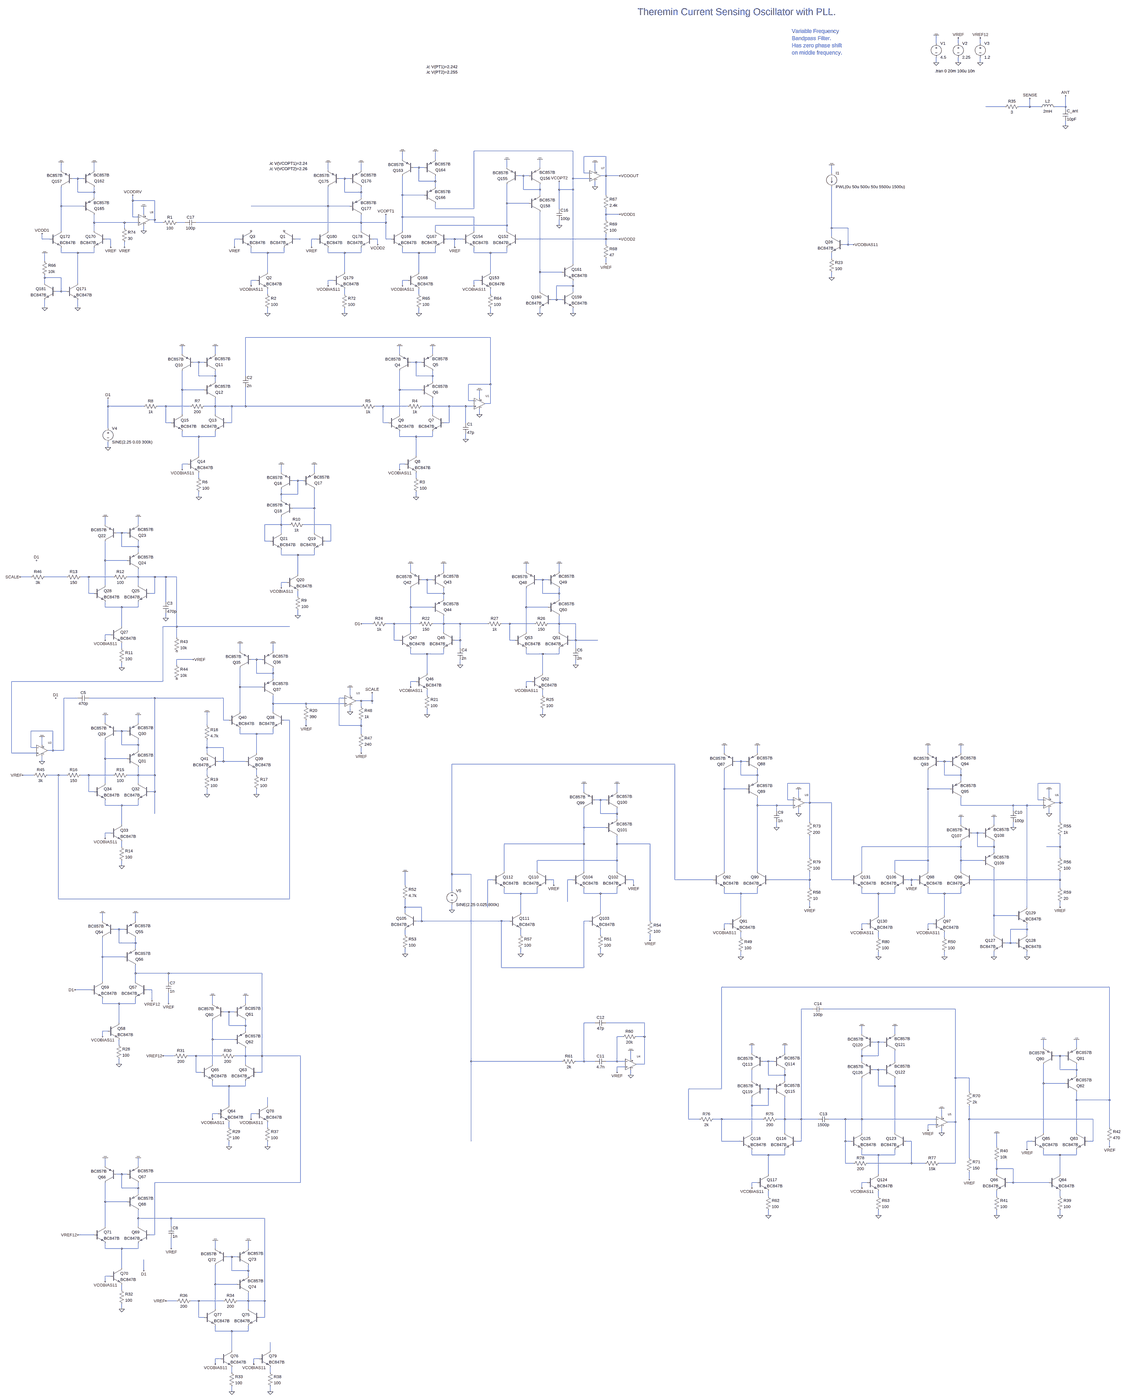
[diagram p0: schematic vco_and_lc_drive_v08.asc, whole sheet]
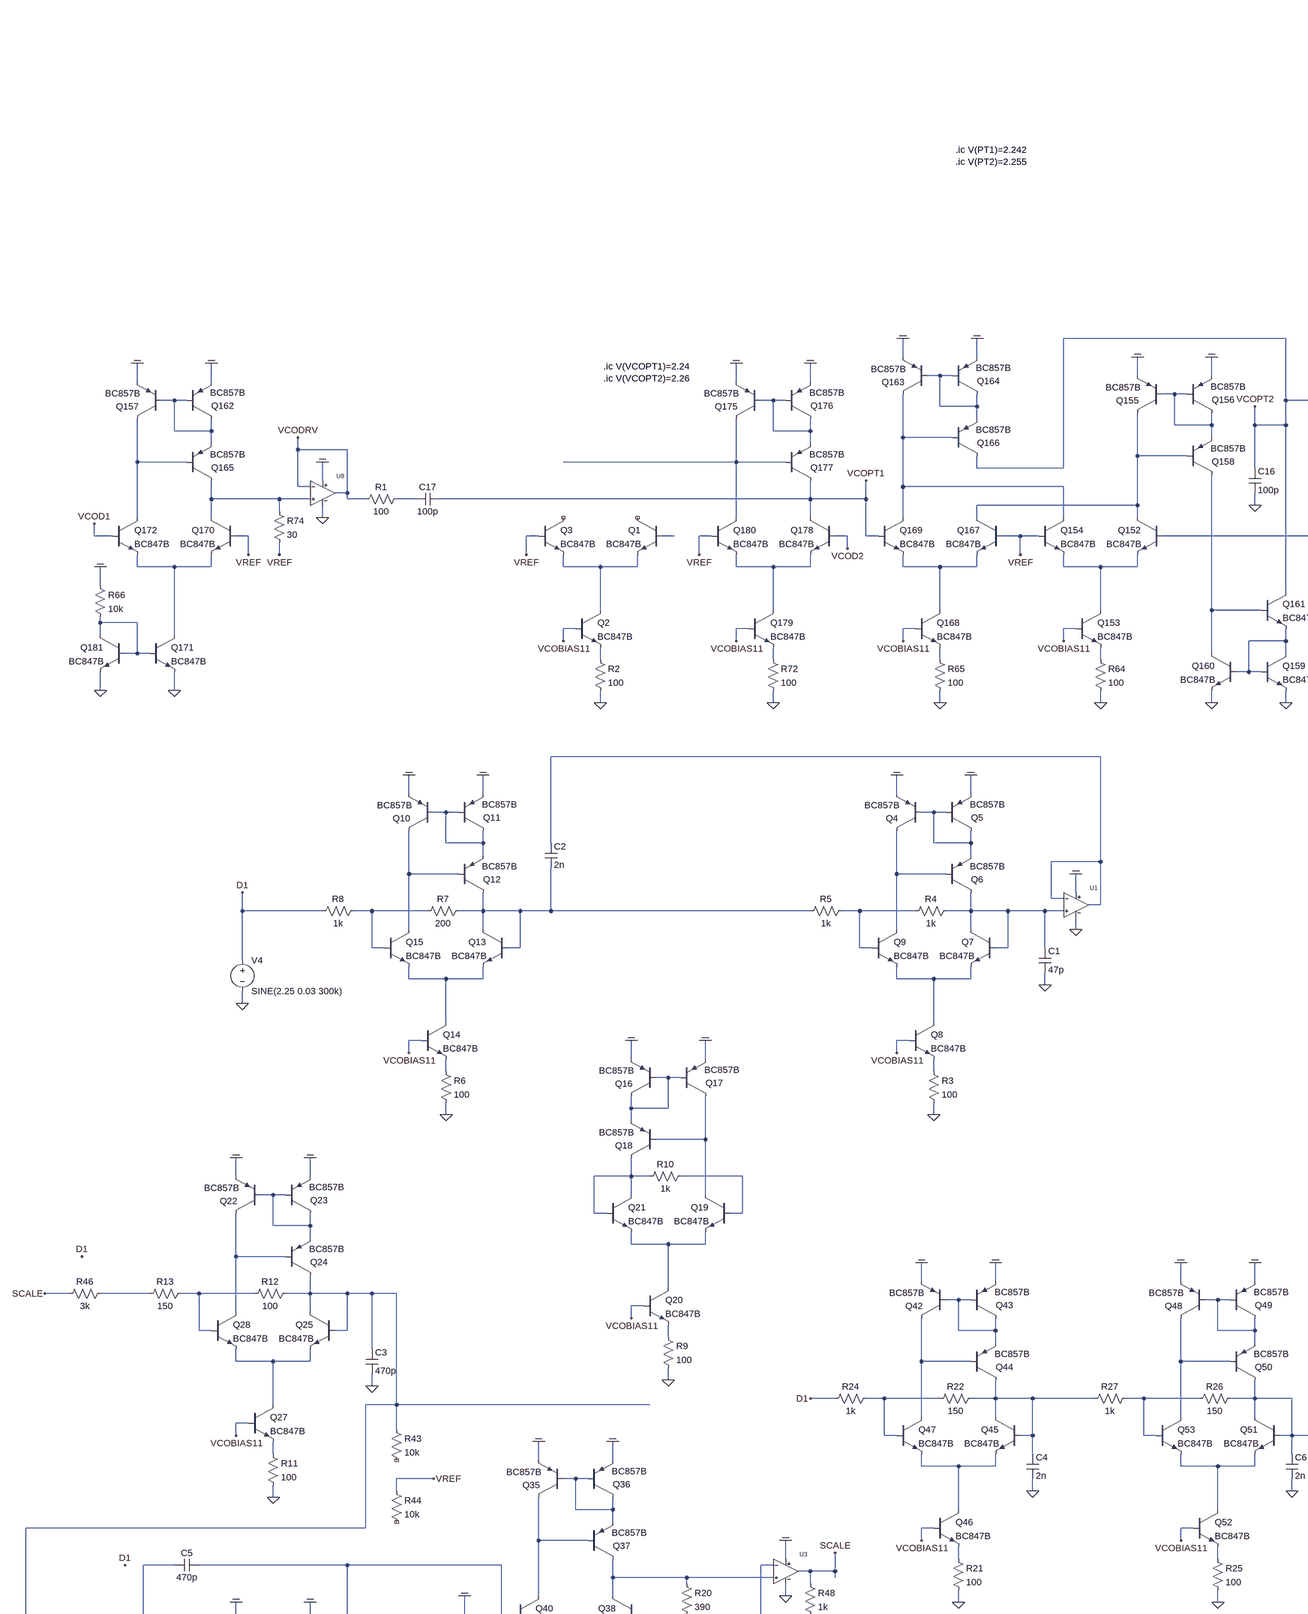
[diagram p1: schematic vco_and_lc_drive_v08.asc, part, row 1 of 2, column 1 of 2]
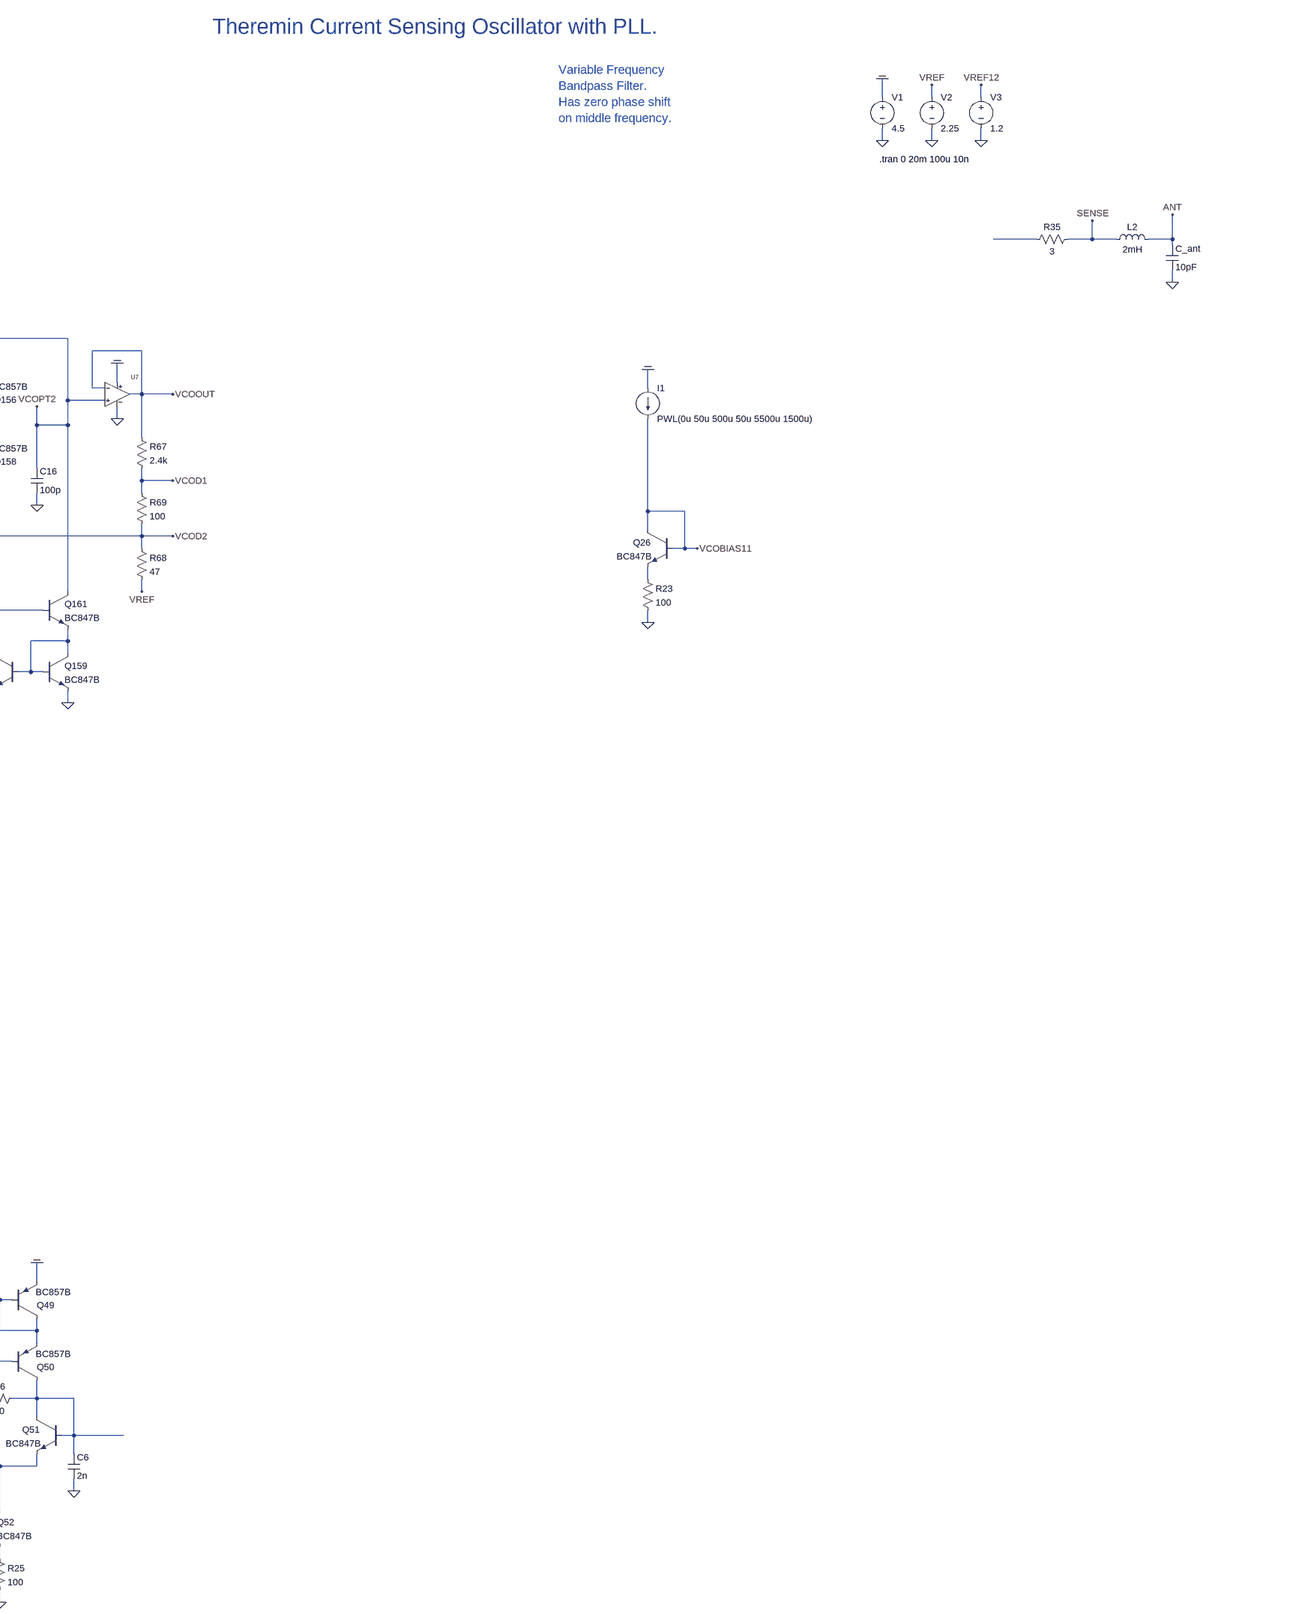
[diagram p2: schematic vco_and_lc_drive_v08.asc, part, row 1 of 2, column 2 of 2]
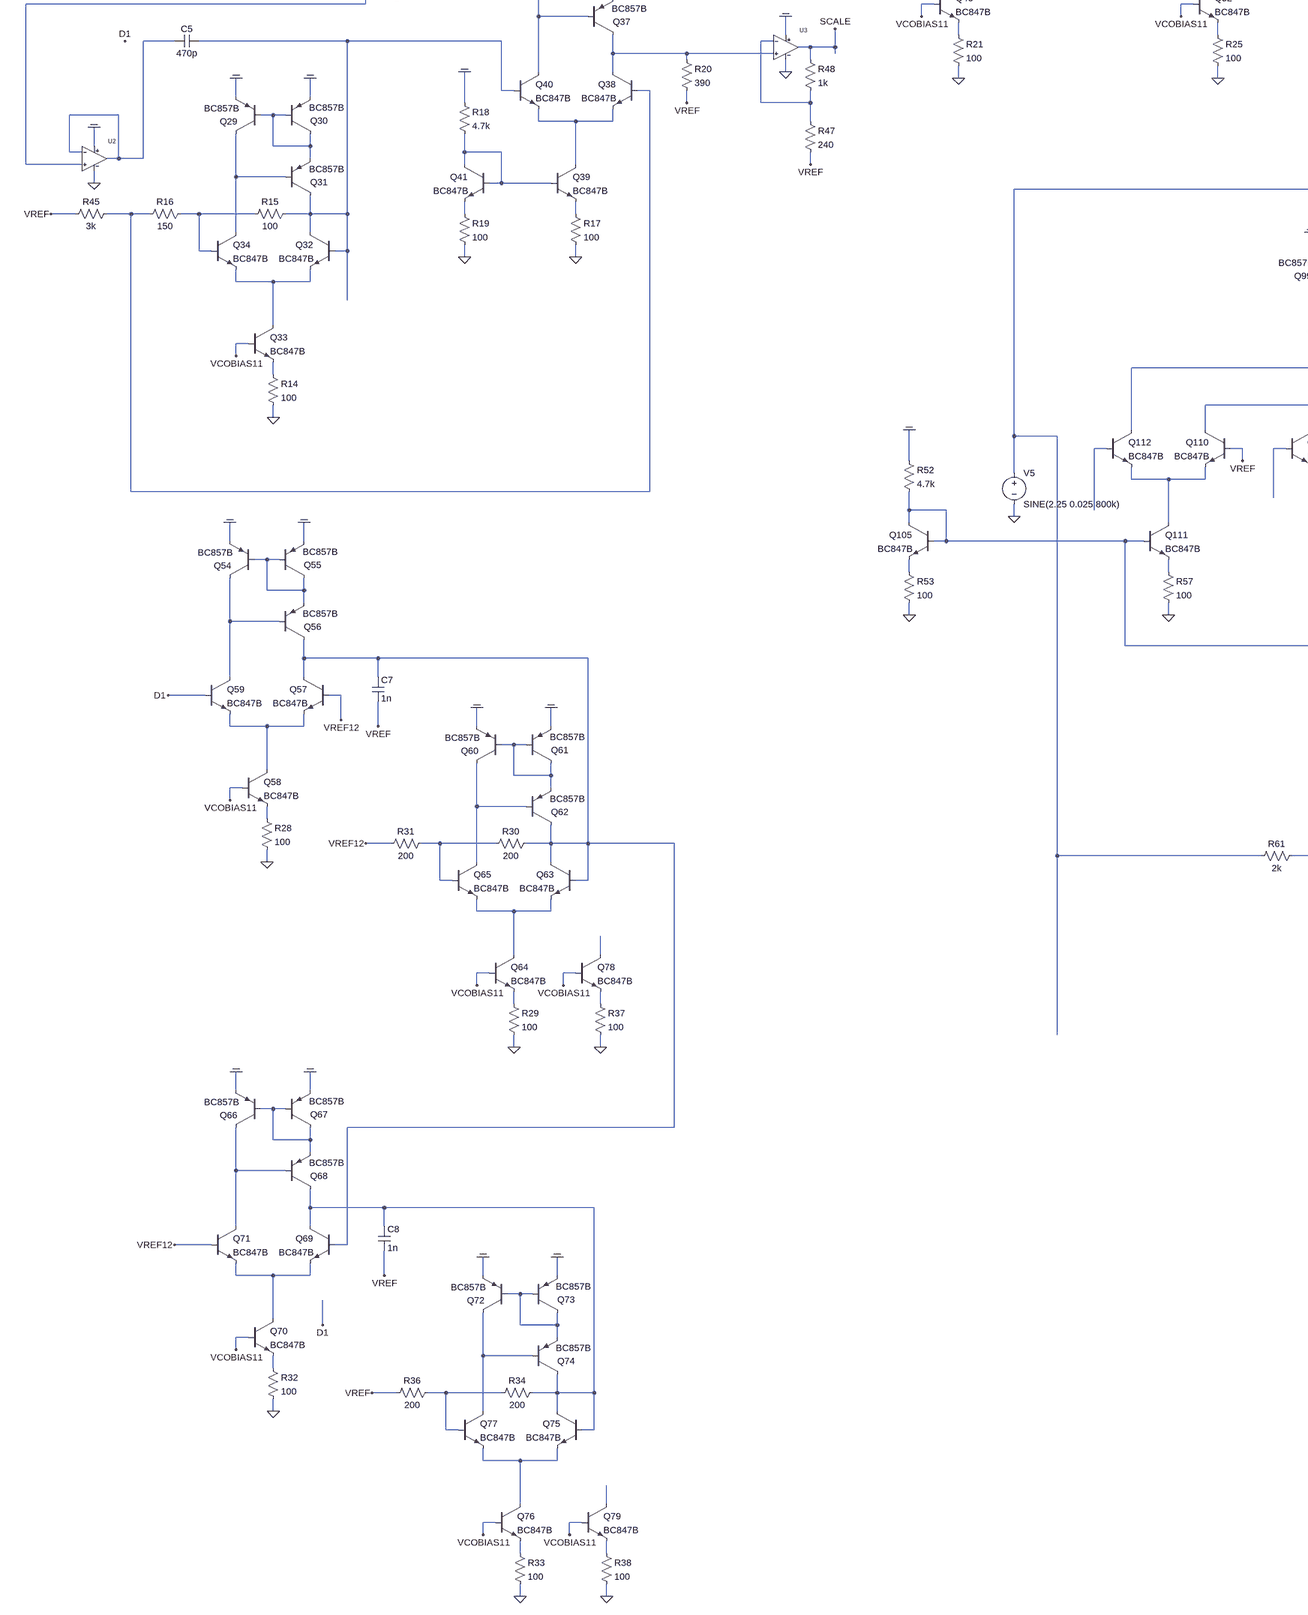
[diagram p3: schematic vco_and_lc_drive_v08.asc, part, row 2 of 2, column 1 of 2]
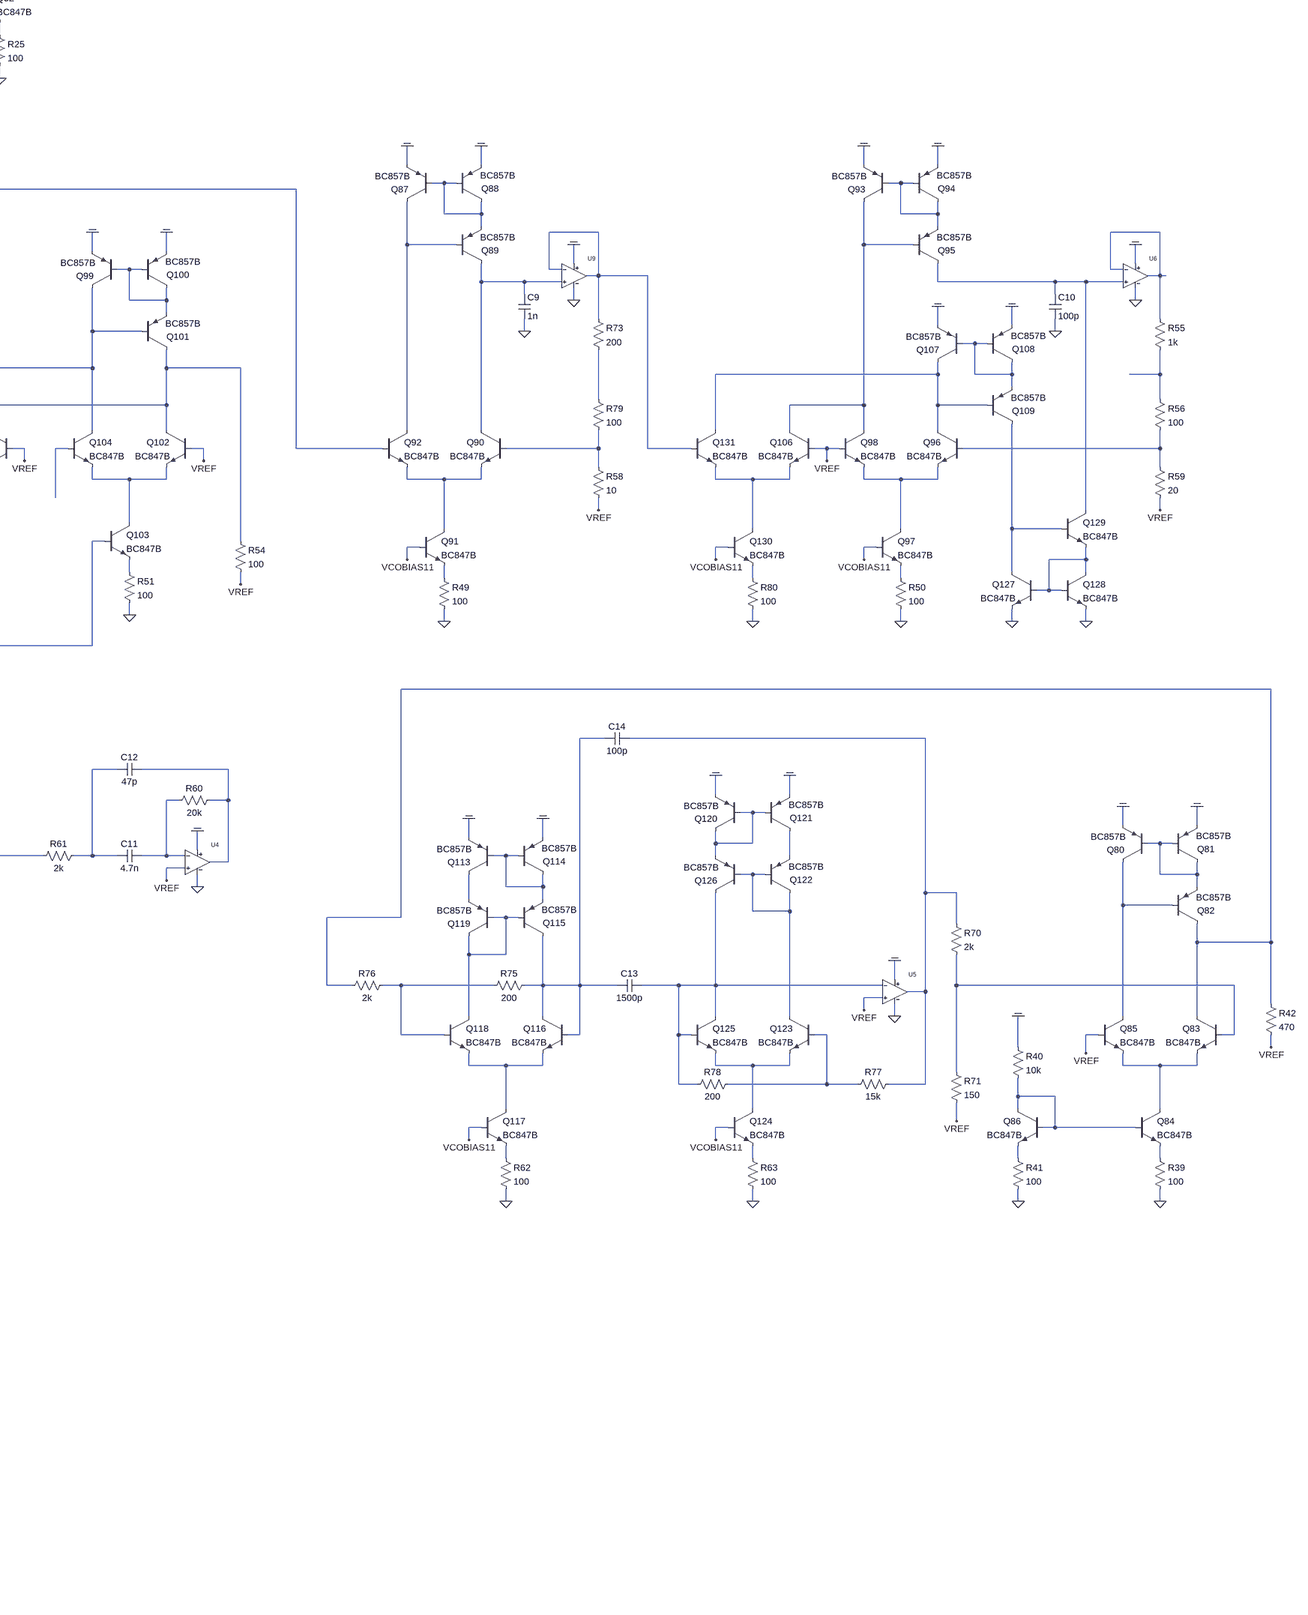
[diagram p4: schematic vco_and_lc_drive_v08.asc, part, row 2 of 2, column 2 of 2]
* vco_and_lc_drive_v08.asc
V1 COM 0 4.5
V2 VREF 0 2.25
L2 SENSE ANT 2mH Rser=120 Cpar=1pF
C_ant ANT 0 10pF
R35 N001 SENSE 3
V3 VREF12 0 1.2
Q26 VCOBIAS11 VCOBIAS11 N018 0 BC847B
R23 N018 0 100
I1 COM VCOBIAS11 PWL(0u 50u 500u 50u 5500u 1500u)
Q152 N007 VCOD2 N017 0 BC847B
Q153 N017 VCOBIAS11 N025 0 BC847B
Q154 N006 VREF N017 0 BC847B
R64 N025 0 100
Q155 N007 N003 COM 0 BC857B
Q156 N003 N003 COM 0 BC857B
Q158 N019 N007 N003 0 BC857B
Q159 N021 N021 0 0 BC847B
Q160 N019 N021 0 0 BC847B
Q161 VCOPT2 N019 N021 0 BC847B
Q163 N006 N002 COM 0 BC857B
Q164 N002 N002 COM 0 BC857B
Q166 VCOPT2 N006 N002 0 BC857B
Q167 N007 VREF N016 0 BC847B
Q168 N016 VCOBIAS11 N024 0 BC847B
Q169 N006 VCOPT1 N016 0 BC847B
R65 N024 0 100
C16 VCOPT2 0 100p
R67 VCOOUT VCOD1 2.4k
R68 VCOD2 VREF 47
R69 VCOD1 VCOD2 100
XU7 VCOPT2 VCOOUT COM 0 VCOOUT MCP6021  ; pins In+ In- V+ V- OUT
Q157 N008 N004 COM 0 BC857B
Q162 N004 N004 COM 0 BC857B
Q165 N010 N008 N004 0 BC857B
Q170 N010 VREF N013 0 BC847B
Q171 N013 N020 0 0 BC847B
Q172 N008 VCOD1 N013 0 BC847B
Q175 N009 N005 COM 0 BC857B
Q176 N005 N005 COM 0 BC857B
Q177 VCOPT1 N009 N005 0 BC857B
Q178 VCOPT1 VCOD2 N015 0 BC847B
Q179 N015 VCOBIAS11 N023 0 BC847B
Q180 N009 VREF N015 0 BC847B
R72 N023 0 100
R74 N010 VREF 30
Q181 N020 N020 0 0 BC847B
R66 COM N020 10k
XU8 N010 VCODRV COM 0 VCODRV MCP6021  ; pins In+ In- V+ V- OUT
C17 VCOPT1 N011 100p
R1 N011 VCODRV 100
Q1 NC_01 N012 N014 0 BC847B
Q2 N014 VCOBIAS11 N022 0 BC847B
Q3 NC_02 VREF N014 0 BC847B
R2 N022 0 100
Q4 N030 N028 COM 0 BC857B
Q5 N028 N028 COM 0 BC857B
Q6 N034 N030 N028 0 BC857B
Q7 N034 N034 N036 0 BC847B
Q8 N036 VCOBIAS11 N038 0 BC847B
Q9 N030 N033 N036 0 BC847B
R3 N038 0 100
R4 N034 N033 1k
R5 N033 N032 1k
Q10 N029 N027 COM 0 BC857B
Q11 N027 N027 COM 0 BC857B
Q12 N032 N029 N027 0 BC857B
Q13 N032 N032 N035 0 BC847B
Q14 N035 VCOBIAS11 N037 0 BC847B
Q15 N029 N031 N035 0 BC847B
R6 N037 0 100
R7 N032 N031 200
R8 N031 D1 1k
C1 N034 0 47p
C2 N026 N032 2n
XU1 N034 N026 COM 0 N026 MCP6021  ; pins In+ In- V+ V- OUT
V4 D1 0 SINE(2.25 0.03 300k)
Q16 N039 N039 COM 0 BC857B
Q17 N040 N039 COM 0 BC857B
Q19 N040 N042 N044 0 BC847B
Q20 N044 VCOBIAS11 N051 0 BC847B
Q21 N041 N041 N044 0 BC847B
R9 N051 0 100
R10 N042 N041 1k
Q18 N041 N040 N039 0 BC857B
Q22 N045 N043 COM 0 BC857B
Q23 N043 N043 COM 0 BC857B
Q24 N048 N045 N043 0 BC857B
Q25 N048 N048 N052 0 BC847B
Q27 N052 VCOBIAS11 N059 0 BC847B
Q28 N045 N047 N052 0 BC847B
R11 N059 0 100
R12 N048 N047 100
R13 N047 N046 150
C3 N048 0 470p
Q29 N074 N071 COM 0 BC857B
Q30 N071 N071 COM 0 BC857B
Q31 N067 N074 N071 0 BC857B
Q32 N067 N067 N086 0 BC847B
Q33 N086 VCOBIAS11 N092 0 BC847B
Q34 N074 N078 N086 0 BC847B
R14 N092 0 100
R15 N067 N078 100
R16 N078 N070 150
C5 N067 N066 470p
Q35 N063 N062 COM 0 BC857B
Q36 N062 N062 COM 0 BC857B
Q37 N069 N063 N062 0 BC857B
Q38 N069 N070 N072 0 BC847B
Q39 N072 N073 N080 0 BC847B
Q40 N063 N067 N072 0 BC847B
R17 N080 0 100
Q41 N073 N073 N079 0 BC847B
R18 COM N073 4.7k
R19 N079 0 100
R20 N069 VREF 390
Q42 N053 N049 COM 0 BC857B
Q43 N049 N049 COM 0 BC857B
Q44 N056 N053 N049 0 BC857B
Q45 N056 N056 N060 0 BC847B
Q46 N060 VCOBIAS11 N064 0 BC847B
Q47 N053 N055 N060 0 BC847B
R21 N064 0 100
R22 N056 N055 150
R24 N055 D1 1k
C4 N056 0 2n
Q48 N054 N050 COM 0 BC857B
Q49 N050 N050 COM 0 BC857B
Q50 N058 N054 N050 0 BC857B
Q51 N058 N058 N061 0 BC847B
Q52 N061 VCOBIAS11 N065 0 BC847B
Q53 N054 N057 N061 0 BC847B
R25 N065 0 100
R26 N058 N057 150
R27 N057 N056 1k
C6 N058 0 2n
Q54 N115 N107 COM 0 BC857B
Q55 N107 N107 COM 0 BC857B
Q56 N116 N115 N107 0 BC857B
Q57 N116 VREF12 N118 0 BC847B
Q58 N118 VCOBIAS11 N127 0 BC847B
Q59 N115 D1 N118 0 BC847B
R28 N127 0 100
C7 N116 VREF 1n
Q60 N125 N121 COM 0 BC857B
Q61 N121 N121 COM 0 BC857B
Q62 N116 N125 N121 0 BC857B
Q63 N116 N116 N135 0 BC847B
Q64 N135 VCOBIAS11 N141 0 BC847B
Q65 N125 N128 N135 0 BC847B
R29 N141 0 100
R30 N116 N128 200
R31 N128 VREF12 200
Q66 N153 N148 COM 0 BC857B
Q67 N148 N148 COM 0 BC857B
Q68 N154 N153 N148 0 BC857B
Q69 N154 N116 N155 0 BC847B
Q70 N155 VCOBIAS11 N158 0 BC847B
Q71 N153 VREF12 N155 0 BC847B
R32 N158 0 100
C8 N154 VREF 1n
Q72 N157 N156 COM 0 BC857B
Q73 N156 N156 COM 0 BC857B
Q74 N154 N157 N156 0 BC857B
Q75 N154 N154 N160 0 BC847B
Q76 N160 VCOBIAS11 N162 0 BC847B
Q77 N157 N159 N160 0 BC847B
R33 N162 0 100
R34 N154 N159 200
R36 N159 VREF 200
Q78 N137 VCOBIAS11 N142 0 BC847B
R37 N142 0 100
Q79 N161 VCOBIAS11 N163 0 BC847B
R38 N163 0 100
Q80 N134 N129 COM 0 BC857B
Q81 N129 N129 COM 0 BC857B
Q82 N117 N134 N129 0 BC857B
Q83 N117 N140 N146 0 BC847B
Q84 N146 N147 N152 0 BC847B
Q85 N134 VREF N146 0 BC847B
R39 N152 0 100
Q86 N147 N147 N151 0 BC847B
R40 COM N147 10k
R41 N151 0 100
R42 N117 VREF 470
R43 N048 NC_03 10k
R44 VREF NC_04 10k
XU2 N048 N066 COM 0 N066 MCP6021  ; pins In+ In- V+ V- OUT
R45 N070 VREF 3k
R46 N046 SCALE 3k
XU3 N069 N068 COM 0 SCALE MCP6021  ; pins In+ In- V+ V- OUT
R47 N068 VREF 240
R48 SCALE N068 1k
Q93 N084 N076 COM 0 BC857B
Q94 N076 N076 COM 0 BC857B
Q95 N088 N084 N076 0 BC857B
Q96 N093 N099 N104 0 BC847B
Q97 N104 VCOBIAS11 N114 0 BC847B
Q98 N084 VREF N104 0 BC847B
R50 N114 0 100
C10 N088 0 100p
Q99 N089 N085 COM 0 BC857B
Q100 N085 N085 COM 0 BC857B
Q101 N091 N089 N085 0 BC857B
Q102 N091 VREF N101 0 BC847B
Q103 N101 N105 N111 0 BC847B
Q104 N089 N097 N101 0 BC847B
R51 N111 0 100
Q105 N105 N105 N109 0 BC847B
R52 COM N105 4.7k
R53 N109 0 100
R54 N091 VREF 100
Q110 N091 VREF N100 0 BC847B
Q111 N100 N105 N110 0 BC847B
Q112 N089 N096 N100 0 BC847B
R57 N110 0 100
R59 N099 VREF 20
V5 N077 0 SINE(2.25 0.025 800k)
XU4 VREF N124 COM 0 N123 MCP6021  ; pins In+ In- V+ V- OUT
R60 N123 N124 20k
C11 N124 N122 4.7n
C12 N123 N122 47p
R61 N122 N077 2k
Q113 N133 N130 COM 0 BC857B
Q114 N130 N130 COM 0 BC857B
Q115 N119 N136 N130 0 BC857B
Q116 N119 N119 N144 0 BC847B
Q117 N144 VCOBIAS11 N149 0 BC847B
Q118 N136 N138 N144 0 BC847B
R62 N149 0 100
Q119 N136 N136 N133 0 BC857B
Q120 N126 N126 COM 0 BC857B
Q121 N131 N126 COM 0 BC857B
Q122 N132 N132 N131 0 BC857B
Q123 N132 N143 N145 0 BC847B
Q124 N145 VCOBIAS11 N150 0 BC847B
Q125 N139 N139 N145 0 BC847B
R63 N150 0 100
Q126 N139 N132 N126 0 BC857B
C13 N139 N119 1500p
C14 N120 N119 100p
XU5 VREF N139 COM 0 N120 MCP6021  ; pins In+ In- V+ V- OUT
R75 N119 N138 200
R76 N138 N117 2k
R77 N120 N143 15k
R78 N143 N139 200
R70 N120 N140 2k
R71 N140 VREF 150
XU6 N088 N082 COM 0 N082 MCP6021  ; pins In+ In- V+ V- OUT
R55 N082 N094 1k
Q107 N093 N090 COM 0 BC857B
Q108 N090 N090 COM 0 BC857B
Q109 N106 N093 N090 0 BC857B
Q127 N106 N108 0 0 BC847B
Q128 N108 N108 0 0 BC847B
Q129 N088 N106 N108 0 BC847B
R56 N094 N099 100
Q87 N083 N075 COM 0 BC857B
Q88 N075 N075 COM 0 BC857B
Q89 N087 N083 N075 0 BC857B
Q90 N087 N098 N102 0 BC847B
Q91 N102 VCOBIAS11 N112 0 BC847B
Q92 N083 N077 N102 0 BC847B
R49 N112 0 100
C9 N087 0 1n
R58 N098 VREF 10
XU9 N087 N081 COM 0 N081 MCP6021  ; pins In+ In- V+ V- OUT
R73 N081 N095 200
R79 N095 N098 100
Q106 N084 VREF N103 0 BC847B
Q130 N103 VCOBIAS11 N113 0 BC847B
Q131 N093 N081 N103 0 BC847B
R80 N113 0 100
.model NPN NPN
.model PNP PNP
.lib standard.bjt
.tran 0 20m 100u 10n
* Theremin Current Sensing Oscillator with PLL.
.ic V(PT1)=2.242
.ic V(PT2)=2.255
* Variable Frequency
* Bandpass Filter.
* Has zero phase shift
* on middle frequency.
.ic V(VCOPT1)=2.24
.ic V(VCOPT2)=2.26
.lib MCP6021.cir
.backanno
.end